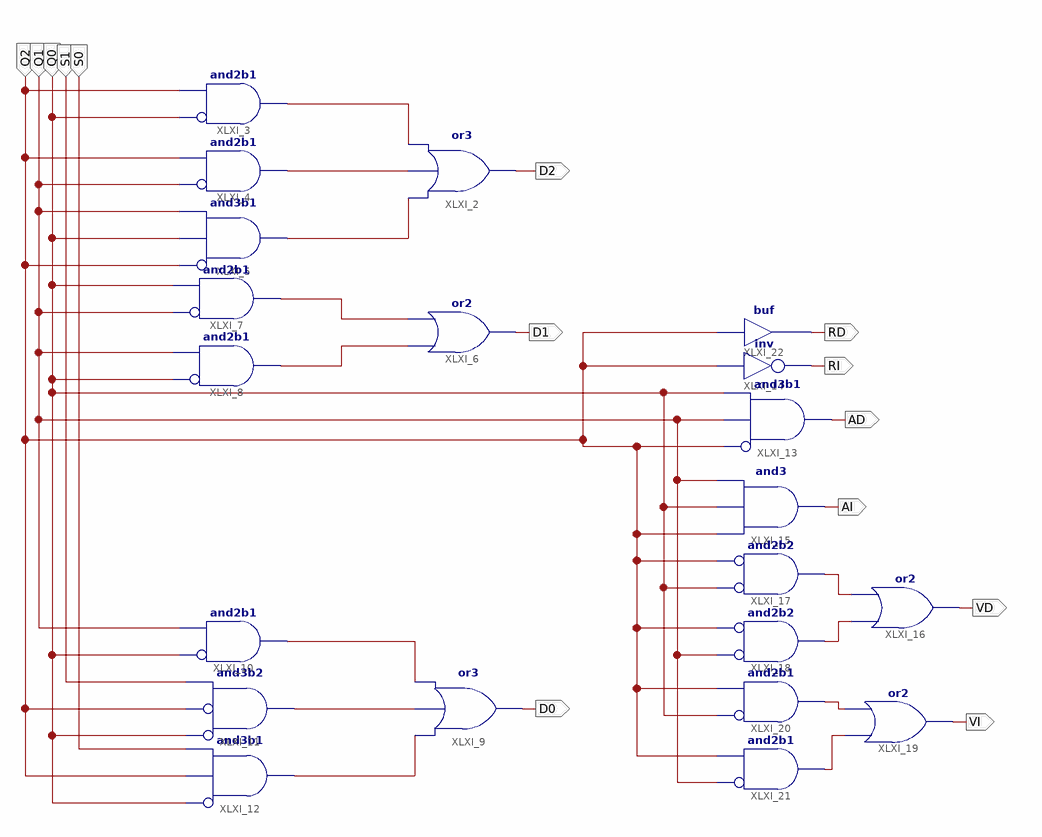
[diagram p0: schematic sheet 1]
// Xilinx ISE schematic control_obras.sch (spartan3) as structural Verilog: 21 symbols, 14 ports
module control_obras (
  input  Q2,
  input  Q1,
  input  Q0,
  input  S1,
  input  S0,
  output D2,
  output D1,
  output D0,
  output RD,
  output RI,
  output AD,
  output AI,
  output VD,
  output VI
);

  wire XLXN_7, XLXN_8, XLXN_9, XLXN_11, XLXN_12, XLXN_14, XLXN_15, XLXN_16, XLXN_23, XLXN_24, XLXN_36,
       XLXN_37;

  or XLXI_2 (D2, XLXN_9, XLXN_8, XLXN_7);
  and XLXI_3 (XLXN_7, ~Q0, Q2);  // and2b1
  and XLXI_4 (XLXN_8, ~Q1, Q2);  // and2b1
  and XLXI_5 (XLXN_9, ~Q2, Q0, Q1);  // and3b1
  or XLXI_6 (D1, XLXN_12, XLXN_11);
  and XLXI_7 (XLXN_11, ~Q1, Q0);  // and2b1
  and XLXI_8 (XLXN_12, ~Q0, Q1);  // and2b1
  and XLXI_12 (XLXN_16, ~Q0, Q2, S0);  // and3b1
  and XLXI_11 (XLXN_15, ~Q0, ~Q2, S1);  // and3b2
  and XLXI_10 (XLXN_14, ~Q0, Q1);  // and2b1
  or XLXI_9 (D0, XLXN_16, XLXN_15, XLXN_14);
  buf XLXI_22 (RD, Q2);
  not XLXI_14 (RI, Q2);
  and XLXI_13 (AD, ~Q2, Q1, Q0);  // and3b1
  and XLXI_15 (AI, Q2, Q0, Q1);
  or XLXI_16 (VD, XLXN_24, XLXN_23);
  and XLXI_17 (XLXN_23, ~Q0, ~Q2);  // and2b2
  and XLXI_18 (XLXN_24, ~Q1, ~Q2);  // and2b2
  or XLXI_19 (VI, XLXN_37, XLXN_36);
  and XLXI_20 (XLXN_36, ~Q0, Q2);  // and2b1
  and XLXI_21 (XLXN_37, ~Q1, Q2);  // and2b1
endmodule
